# EAGLE design rev_D (EAGLE 9.5.2)
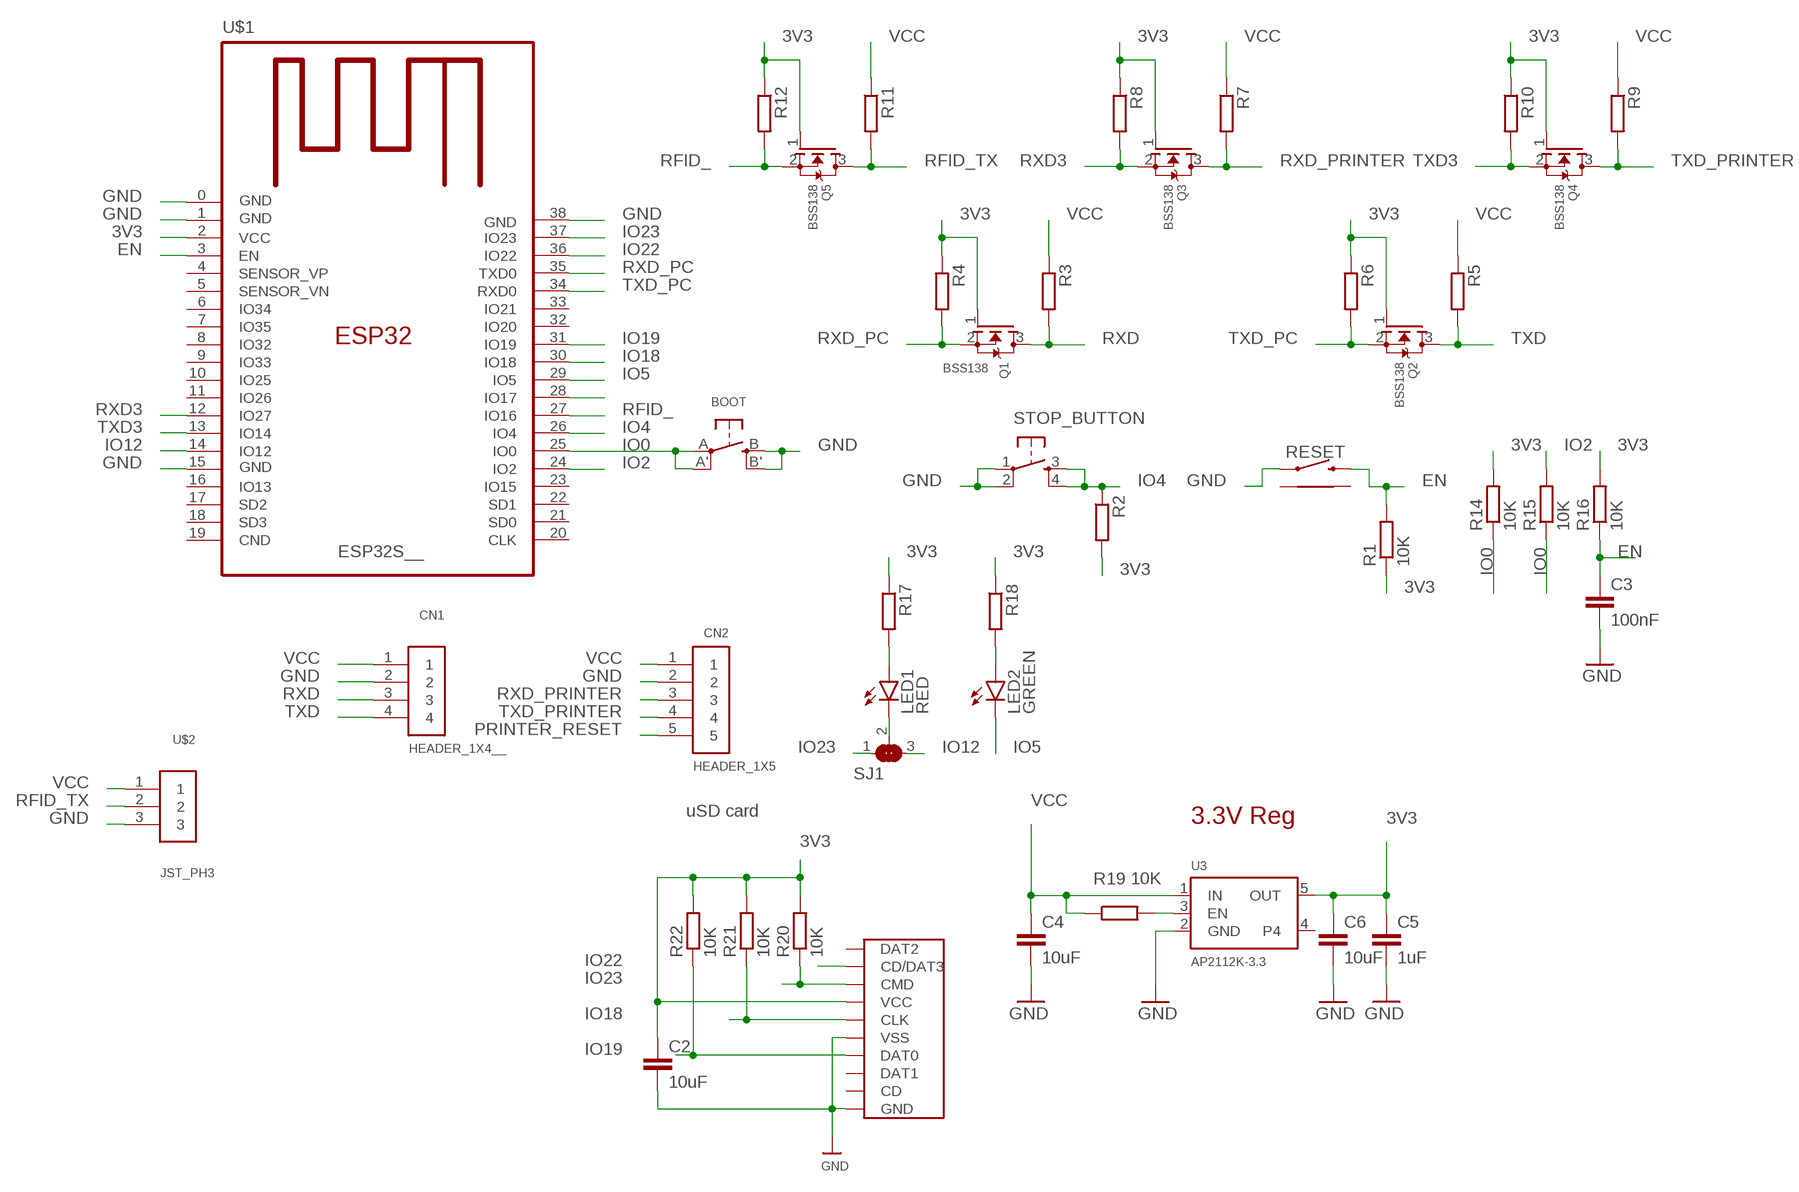
[diagram p0: schematic, sheet 1]

## Parts
BOOT  BUTTON_KMR2_4.6X2.8  [BUTTON_KMR2_4.6X2.8]
C2  10uF  C-EUC0805  [C0805]
C3  100nF  C-EUC0805  [C0805]
C4  10uF  C-EUC0805  [C0805]
C5  1uF  C-EUC0805  [C0805]
C6  10uF  C-EUC0805  [C0805]
CN1  HEADER_1X4__  [HEADER_1X4_RIGHT_ANGLE]
CN2  HEADER_1X5  [HEADER_1X5]
LED1  RED  LEDCHIP-LED0805  [CHIP-LED0805]
LED2  GREEN  LEDCHIP-LED0805  [CHIP-LED0805]
Q1  BSS138  MOSFET_N_  [SOT95P240X110-3]
Q2  BSS138  MOSFET_N_  [SOT95P240X110-3]
Q3  BSS138  MOSFET_N_  [SOT95P240X110-3]
Q4  BSS138  MOSFET_N_  [SOT95P240X110-3]
Q5  BSS138  MOSFET_N_  [SOT95P240X110-3]
R1  10K  R-EU_R0805  [R0805]
R2  10K  R-EU_R0805  [R0805]
R3  10K  R-EU_R0805  [R0805]
R4  10K  R-EU_R0805  [R0805]
R5  10K  R-EU_R0805  [R0805]
R6  10K  R-EU_R0805  [R0805]
R7  10K  R-EU_R0805  [R0805]
R8  10K  R-EU_R0805  [R0805]
R9  10K  R-EU_R0805  [R0805]
R10  10K  R-EU_R0805  [R0805]
R11  10K  R-EU_R0805  [R0805]
R12  10K  R-EU_R0805  [R0805]
R14  10K  R-EU_R0805  [R0805]
R15  10K  R-EU_R0805  [R0805]
R16  10K  R-EU_R0805  [R0805]
R17  470R  R-EU_R0805  [R0805]
R18  470R  R-EU_R0805  [R0805]
R19  10K  R-EU_R0805  [R0805]
R20  10K  R-EU_R0805  [R0805]
R21  10K  R-EU_R0805  [R0805]
R22  10K  R-EU_R0805  [R0805]
RESET  TACTILE_SWITCH_RIGHT_ANGLE_THT_  [TACTILE_SWITCH_RIGHT_ANGLE_THT]
SD_CARD  MICRO_SD_CARD_  [TFP09-2--12B]
SJ1  SOLDERJUMPER_2WAY0805  [SOLDERJUMPER_2WAY_OPEN_0805]
STOP_BUTTON  TACTILE_SWITCH_LONG_THT_  [TACTILE_SWICTH_THT]
U3  AP2112K-3.3  AP2112K-3.3_  [SOT95P290X120-5]
U$1  ESP32S__  [ESP32S]
U$2  JST_PH3  [JST-PH3]

## Nets
3V3: C2.1 C5.1 C6.1 Q1.1(G) Q2.1(G) Q3.1(G) Q4.1(G) Q5.1(G) R1.1 R2.2 R4.1 R6.1 R8.1 R10.1 R12.1 R14.2 R16.2 R17.1 R18.1 R20.2 R21.2 R22.2 SD_CARD.VCC U3.5(OUT) U$1.2(VCC)
EN: C3.1 R1.2 R16.1 RESET.2 U$1.3(EN)
GND: BOOT.B'(S1) BOOT.B(S) C2.2 C3.2 C4.2 C5.2 C6.2 CN1.2 CN2.2 RESET.1 SD_CARD.GND SD_CARD.GND@1(GND) SD_CARD.GND@2(GND) SD_CARD.GND@3(VSS) SD_CARD.VSS(GND) STOP_BUTTON.1 STOP_BUTTON.2 U3.2(GND) U$1.0(GND) U$1.1(GND) U$1.15(GND) U$1.38(GND) U$2.3
IO0: BOOT.A'(P1) BOOT.A(P) R14.1 R15.1 U$1.25(IO0)
IO2: R15.2 U$1.24(IO2)
IO4: R2.1 STOP_BUTTON.3 STOP_BUTTON.4 U$1.26(IO4)
IO5: LED2.C U$1.29(IO5)
IO12: SJ1.3 U$1.14(IO12)
IO18: R21.1 SD_CARD.CLK U$1.30(IO18)
IO19: R22.1 SD_CARD.DAT0 U$1.31(IO19)
IO22: SD_CARD.CD/DAT3 U$1.36(IO22)
IO23: R20.1 SD_CARD.CMD SJ1.1 U$1.37(IO23)
N$1: LED1.C SJ1.2
N$2: U$1.28(IO17)
N$3: LED1.A R17.2
N$4: LED2.A R18.2
N$16: R19.2 U3.3(EN)
PRINTER_RESET: CN2.5
RFID_: Q5.2(S) R12.2 U$1.27(IO16)
RFID_TX: Q5.3(D) R11.2 U$2.2
RXD: CN1.3 Q1.3(D) R3.2
RXD3: Q3.2(S) R8.2 U$1.12(IO27)
RXD_PC: Q1.2(S) R4.2 U$1.35(TXD0)
RXD_PRINTER: CN2.3 Q3.3(D) R7.2
TXD: CN1.4 Q2.3(D) R5.2
TXD3: Q4.2(S) R10.2 U$1.13(IO14)
TXD_PC: Q2.2(S) R6.2 U$1.34(RXD0)
TXD_PRINTER: CN2.4 Q4.3(D) R9.2
VCC: C4.1 CN1.1 CN2.1 R3.1 R5.1 R7.1 R9.1 R11.1 R19.1 U3.1(IN) U$2.1
Unconnected: RESET.ANCHOR1 RESET.ANCHOR2 SD_CARD.CD SD_CARD.DAT1 SD_CARD.DAT2 U3.4 U$1.4(SENSOR_VP) U$1.5(SENSOR_VN) U$1.6(IO34) U$1.7(IO35) U$1.8(IO32) U$1.9(IO33) U$1.10(IO25) U$1.11(IO26) U$1.16(IO13) U$1.17(SD2) U$1.18(SD3) U$1.19(CND) U$1.20(CLK) U$1.21(SD0) U$1.22(SD1) U$1.23(IO15) U$1.32(IO20) U$1.33(IO21)

## Notes on the sheet
- uSD card
- 3.3V Reg

## Library data of the parts
BOOT = dronecz:BUTTON_KMR2_4.6X2.8: SMT Tact Switches 6x6mm - Digikey: P12940SCT-ND KMR2 (4.6x2.8mm) - Digikey: 401-1426-1-ND EVQ-PQHB55 - Light Touch, 160GF (4.5x4.5mm) - Digikey: P8090SCT-ND Farnell (KMR221NG) - 2845727
C2-C6 = rcl:C-EU: CAPACITOR, European symbol; SPICEPREFIX: C
CN1 = dronecz:HEADER_1X4
CN2 = dronecz:HEADER_1X5
LED1 LED2 = led:LED: LED OSRAM: - CHIPLED LG R971, LG N971, LY N971, LG Q971, LY Q971, LO R971, LY R971 LH N974, LH R974 LS Q976, LO Q976, LY Q976 LO Q996 - Hyper CHIPLED LW Q18S LB Q993, LB Q99A, LB R99A - SideLED LS A670, LO A670, LY A670, LG A670, LP A670 LB A673, LV A673, LT A673, LW A673 LH A674 LY A675 LS A676, LA A676, LO A676, LY A676, LW A676 LS A679, LY A679, LG A679 - Hyper Micro SIDELED® LS Y876, LA Y876, LO Y876, LY Y876 LT Y87S - SmartLED LW L88C, LW L88S LB L89C, LB L89S, LG L890 LS L89K, LO L89K, LY L89K LS L896, LA L896, LO L896, LY L896 - TOPLED LS T670, LO T670, LY T670, LG T670, LP T670 LSG T670, LSP T670, LSY T670, LOP T670, LYG T670 LG T671, LOG T671, LSG T671 LB T673, LV T673, LT T673, LW T673 LH T674 LS T676, LA T676, LO T676, LY T676, LB T676, LH T676, LSB T676, LW T676 LB T67C, LV T67C, LT T67C, LS T67K, LO T67K, LY T67K, LW E67C LS E67B, LA E67B, LO E67B, LY E67B, LB E67C, LV E67C, LT E67C LW T67C LS T679, LY T679, LG T679 LS T770, LO T770, LY T770, LG T770, LP T770 LB T773, LV T773, LT T773, LW T773 LH T774 LS E675, LA E675, LY E675, LS T675 LS T776, LA T776, LO T776, LY T776, LB T776 LHGB T686 LT T68C, LB T68C - Hyper Mini TOPLED® LB M676 - Mini TOPLED Santana® LG M470 LS M47K, LO M47K, LY M47K Source: http://www.osram.convergy.de LUXEON: - LUMILED® LXK2-PW12-R00, LXK2-PW12-S00, LXK2-PW14-U00, LXK2-PW14-V00 LXK2-PM12-R00, LXK2-PM12-S00, LXK2-PM14-U00 LXK2-PE12-Q00, LXK2-PE12-R00, LXK2-PE12-S00, LXK2-PE14-T00, LXK2-PE14-U00 LXK2-PB12-K00, LXK2-PB12-L00, LXK2-PB12-M00, LXK2-PB14-N00, LXK2-PB14-P00, LXK2-PB14-Q00 LXK2-PR12-L00, LXK2-PR12-M00, LXK2-PR14-Q00, LXK2-PR14-R00 LXK2-PD12-Q00, LXK2-PD12-R00, LXK2-PD12-S00 LXK2-PH12-R00, LXK2-PH12-S00 LXK2-PL12-P00, LXK2-PL12-Q00, LXK2-PL12-R00 Source: www.luxeon.com KINGBRIGHT: KA-3528ASYC Source: www.kingbright.com
Q1-Q5 = dronecz:MOSFET_N
R1-R12 R14-R22 = rcl:R-EU_: RESISTOR, European symbol; SPICEPREFIX: R
RESET = dronecz:TACTILE_SWITCH_RIGHT_ANGLE_THT
SD_CARD = dronecz:MICRO_SD_CARD
SJ1 = microbuilder:SOLDERJUMPER_2WAY: 2-Way Solder Jumper
STOP_BUTTON = dronecz:TACTILE_SWITCH_LONG_THT
U3 = dronecz:AP2112K-3.3
U$1 = dronecz:ESP32S
U$2 = dronecz:JST_PH3

## Board
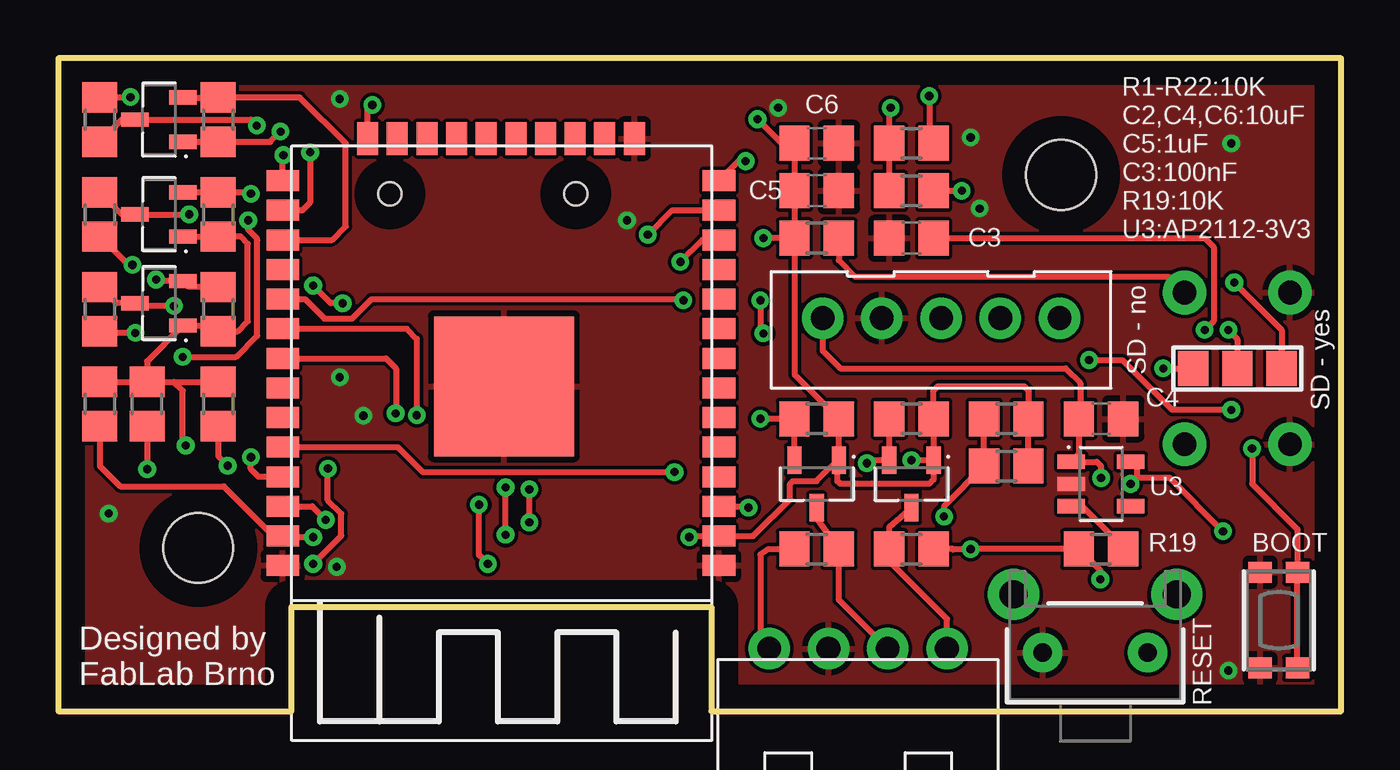
[diagram p1: board, top side]
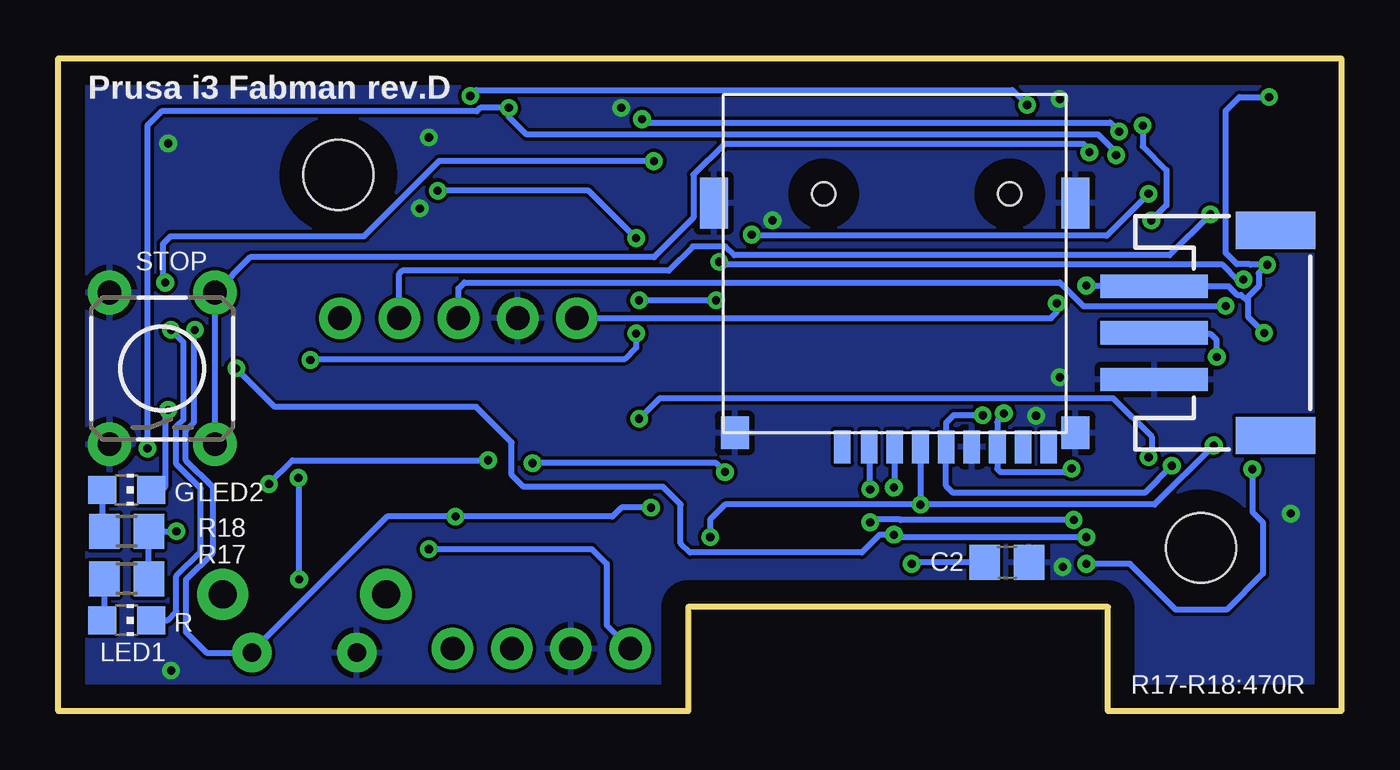
[diagram p2: board, bottom side, seen from below]

Size 55 x 28 mm. Coordinates in mm from the lower left corner, seen from the top.
Outline: 28,0 55,0 55,28 0,28 0,0 10,0 10,4.47 28,4.47 28,0
Copper layers (1*16): Top 0.035mm / dielectric 1.5mm / Bottom 0.035mm
Design rules "default": minimum track width 6mil, minimum drill 0.35mm, track to track 6mil, track to pad 6mil, pad to pad 6mil, via to via 6mil, smd to smd 6mil, copper to edge 40mil, drill to drill 6mil, minimum pad ring 10mil, minimum via ring 8mil, stop-mask expansion 4mil, vias tented up to drill 0mil, thermal gap 10mil
Holes 3 mm at 43,23 6,7

### Footprints (pad centres in the part's own frame; a part is rotated, then mirrored left to right if it is on the bottom)
BUTTON_KMR2_4.6X2.8 = smd 0.9 x 1: A 2.05,0.8; A' -2.05,0.8; B 2.05,-0.8; B' -2.05,-0.8
C0805 = smd 1.3 x 1.5: 1 -0.95,0; 2 0.95,0
HEADER_1X4_RIGHT_ANGLE = drill 1.016 pad 1.778: 1 -3.81,0; 2 -1.27,0; 3 1.27,0; 4 3.81,0
HEADER_1X5 = drill 1.016 pad 1.778: 1 -5.08,0; 2 -2.54,0; 3 0,0; 4 2.54,0; 5 5.08,0
CHIP-LED0805 = smd 1.2 x 1.2: A 0,-1.05; C 0,1.05
SOT95P240X110-3 = smd 1.18 x 0.609: 1 -1.024,0.95; 2 -1.024,-0.95; 3 1.024,0
R0805 = smd 1.3 x 1.5: 1 -0.95,0; 2 0.95,0
TACTILE_SWITCH_RIGHT_ANGLE_THT = drill 0.8 pad 1.7: 1 2.25,0; 2 -2.25,0 | drill 1.2 pad 2.2: ANCHOR1 3.5,-2.5; ANCHOR2 -3.5,-2.5
TFP09-2--12B = smd 0.711 x 1.422: CD -6.6,7.85; CD/DAT3 1.1,7.85; CLK -2.2,7.85; CMD 0,7.85; DAT0 -4.4,7.85; DAT1 -5.5,7.85; DAT2 2.25,7.85; VCC -1.1,7.85; VSS -3.3,7.85 | smd 1.2 x 2.2: GND -7.75,-2.6; GND@1 7.75,-2.6 | smd 1.2 x 1.4: GND@2 -7.75,7.25; GND@3 6.85,7.25 | hole 1: -4.93,-3; 3.05,-3
SOLDERJUMPER_2WAY_OPEN_0805 = smd 1.3 x 1.5: 1 -1.9,0; 2 0,0; 3 1.9,0
TACTILE_SWICTH_THT = drill 1.016 pad 1.88: 1 -3.251,2.261; 2 3.251,2.261; 3 -3.251,-2.261; 4 3.251,-2.261
SOT95P290X120-5 = smd 1.18 x 0.609: 1 -1.274,0.95; 2 -1.274,0; 3 -1.274,-0.95; 4 1.274,-0.95; 5 1.274,0.95
ESP32S = smd 6 x 6: 0 0.026,-0.121 | smd 1.4 x 0.9: 1 -9.194,7.569; 2 -9.194,6.298; 3 -9.194,5.029; 4 -9.194,3.759; 5 -9.194,2.489; 6 -9.194,1.218; 7 -9.194,-0.051; 8 -9.194,-1.321; 9 -9.194,-2.591; 10 -9.194,-3.861; 11 -9.194,-5.131; 12 -9.194,-6.402; 13 -9.194,-7.671; 14 -9.194,-8.941; 25 9.507,-8.941; 26 9.507,-7.671; 27 9.507,-6.402; 28 9.507,-5.131; 29 9.507,-3.861; 30 9.507,-2.591; 31 9.507,-1.321; 32 9.507,-0.051; 33 9.507,1.218; 34 9.507,2.489; 35 9.507,3.759; 36 9.507,5.029; 37 9.507,6.298; 38 9.507,7.569 | smd 0.9 x 1.4: 15 -5.564,-10.742; 16 -4.293,-10.742; 17 -3.023,-10.742; 18 -1.754,-10.742; 19 -0.483,-10.742; 20 0.786,-10.742; 21 2.057,-10.742; 22 3.326,-10.742; 23 4.596,-10.742; 24 5.867,-10.742
JST-PH3 = smd 1 x 4.6: 1 -2,-3.7; 2 0,-3.7; 3 2,-3.7 | smd 1.6 x 3.4: NC1 -4.4,1.5; NC2 4.4,1.5

### Placement (x,y rotation side)
BOOT  52.32,3.9 270 top
C2  14.33,6.38 0 bottom
C3  36.58,20.29 180 top
C4  44.7,12.54 0 top
C5  32.51,22.32 0 top
C6  32.51,24.35 0 top
CN1  34.29,2.68 0 top
CN2  37.85,16.86 0 top
LED1  52.07,3.9 270 bottom
LED2  52.07,9.49 270 bottom
Q1  32.51,9.75 270 top
Q2  36.58,9.75 270 top
Q3  4.32,17.49 180 top
Q4  4.32,21.3 180 top
Q5  4.32,25.37 180 top
R1  40.64,12.54 180 top
R2  32.51,20.29 180 top
R3  32.51,6.95 0 top
R4  32.51,12.54 180 top
R5  36.58,6.95 180 top
R6  36.58,12.54 180 top
R7  1.78,17.24 90 top
R8  6.86,17.24 90 top
R9  1.78,21.3 90 top
R10  6.86,21.3 90 top
R11  1.78,25.37 270 top
R12  6.86,25.37 90 top
R14  36.58,22.32 0 top
R15  36.58,24.35 0 top
R16  40.64,10.51 0 top
R17  52.07,5.68 180 bottom
R18  52.07,7.71 180 bottom
R19  44.7,6.95 0 top
R20  1.78,13.18 90 top
R21  6.86,13.18 90 top
R22  3.8,13.18 90 top
RESET  44.45,2.51 180 top
SD_CARD  19.14,19.19 180 bottom
SJ1  50.55,14.7 0 top
STOP_BUTTON  50.55,14.7 90 bottom
U3  44.7,9.75 0 top
U$1  19.13,13.81 180 top
U$2  4.32,16.22 270 bottom

### Tracks (layer width: path | path; a pad name or v marks a point on that pad's centre or on a via)
3V3  (via drill 0.35)
  Top 0.254: Q1.1 R4.1 31.56,14.44 R2.2 | Q1.1 33.46,10.82 32.51,9.87 31.5,9.87 31.37,9.75 31.37,9.09 29.79,7.51 U$1.2 27.1,7.51 v27.05,7.46 | R2.2 C5.1 C6.1 31.01,24.35 v29.97,25.39 | Q2.1 R6.1 37.53,13.74 37.72,13.94 41.4,13.94 41.59,13.75 R1.1 R16.2 | Q2.1 37.53,9.94 37.34,9.75 33.53,9.75 33.4,9.87 33.4,10.71 Q1.1 | v36.58,10.76 36.58,10.77 Q2.1 | 46.23,10.01 v45.97,9.75 | v49.93,7.71 47.64,10.01 46.23,10.01 | Q5.1 R12.1 9.08,24.42 v9.53,24.86 | Q4.1 R10.1 7.81,20.35 8.13,20.03 8.13,16.73 7.69,16.29 R8.1 6.6,16.54 Q3.1 3.8,15 R22.2 | R14.2 v38.73,22.32 | R2.2 v30.23,20.29 | U3.5 46.23,10.44 46.23,10.01 | R20.2 R22.2 | R22.2 4.95,14.13 | 4.95,14.13 R21.2 | v5.46,11.4 5.33,11.53 5.33,13.74 4.95,14.13 | v18.41,6.32 18.29,6.45 18.03,6.7 v18.03,8.86
  Bottom 0.254: v45.97,9.75 44.96,10.76 v36.58,10.76 | R17.1 R18.1 v49.93,7.71 | v5.46,11.4 8,8.86 v18.03,8.86 | v27.05,7.46 27.05,8.22 26.42,8.86 v18.03,8.86 | v9.53,24.86 9.91,25.24 29.82,25.24 v29.97,25.39 | v30.23,20.29 32.26,22.32 v38.73,22.32 | C2.1 18.35,6.38 v18.41,6.32 | SD_CARD.VCC v18.04,8.86 v18.03,8.86
EN  (via drill 0.35)
  Top 0.254: U$1.3 29.54,8.78 v29.59,8.73 | R1.2 R16.1 37.97,8.79 v37.97,8.35 | C3.1 49.15,20.29 49.53,19.91 49.53,16.73 v49.15,16.35
  Bottom 0.254: v29.59,8.73 30.86,8.73 31.24,8.35 v37.97,8.35 40.89,8.35 46.7,2.54 RESET.2 48.64,2.51 49.53,3.4 49.53,5.63 48.39,6.78 48.39,9.62 49.53,10.76 49.53,12.03 49.2,12.36 49.2,16.3 v49.15,16.35
GND  (via drill 0.35)
  other vias: 39.5,21.56 50.16,1.75 24.38,21.05 13.08,12.67 2.16,8.48 11.94,6.19 12.06,14.32 50.29,24.35 39.12,24.61 30.86,25.88 12.06,26.26
  pour Bottom: 0,28.16 -0.13,-0.03 54.99,-0.03 55.12,28.16
  pour Top: -0.13,28.16 -0.13,-0.03 55.12,-0.03 55.12,28.16
IO0  (via drill 0.35)
  Top 0.254: R14.1 R15.1 35.63,25.82 v35.69,25.88 | v51.18,11.27 51.18,9.75 53.12,7.8 BOOT.A' BOOT.A | U$1.25 9.62,23.82 v9.65,23.84
  Bottom 0.254: v51.18,11.27 51.18,25.11 50.57,25.73 37.07,25.73 36.92,25.88 v35.69,25.88 35.69,25.5 34.92,24.73 10.41,24.73 9.65,23.97 v9.65,23.84
IO2  (via drill 0.35)
  Top 0.254: v13.46,26 13.26,25.8 U$1.24 | v37.34,26.38 37.34,24.54 R15.2
  Bottom 0.254: v37.34,26.38 37.08,26.64 14.1,26.64 v13.46,26
IO4  (via drill 0.35)
  Top 0.254: R2.1 33.46,19.34 34.16,18.64 47.6,18.64 STOP_BUTTON.4 | U$1.26 10.47,21.48 10.79,21.81 v10.79,23.97
  Bottom 0.254: STOP_BUTTON.3 STOP_BUTTON.4 46.77,19.47 29.46,19.47 27.77,21.16 27.77,23 26.45,24.33 11.05,24.33 10.79,24.07 v10.79,23.97
IO5  (via drill 0.35)
  Top 0.254: v26.8,17.62 26.74,17.67 13.43,17.67 12.59,16.84 11.41,16.84 10.57,17.67 U$1.29 | v30.1,17.62 30.1,16.33 v30.23,16.2 | v50.29,12.92 47.75,12.92 45.62,15.06 v44.2,15.06
  Bottom 0.254: v26.8,17.62 v30.1,17.62 | v30.23,16.2 30.23,15.59 30.71,15.11 44.15,15.11 v44.2,15.06 | LED2.C 50.55,9.49 50.42,9.62 50.42,12.79 v50.29,12.92
IO12  (via drill 0.35)
  Top 0.254: U$1.14 29.16,23.59 v29.46,23.59 | v50.42,18.38 52.45,16.35 52.45,15.46 52.45,15.45 SJ1.3
  Bottom 0.254: v29.46,23.59 38.67,23.59 41.91,20.36 50.2,20.36 50.52,20.03 50.52,18.48 v50.42,18.38
IO18  (via drill 0.35)
  Top 0.254: R21.1 6.86,10.93 v7.26,10.53 | U$1.30 14.93,16.4 15.37,15.97 v15.37,12.69
  Bottom 0.254: v7.26,10.53 8.42,9.37 16.64,9.37 16.94,9.67 SD_CARD.CLK 16.94,12.37 16.61,12.69 v15.37,12.69
IO19  (via drill 0.35)
  Top 0.254: R22.1 3.8,10.39 v3.81,10.38 | U$1.31 14.04,15.13 14.48,14.7 14.48,12.79 v14.46,12.77 | v11.56,10.4 11.56,9.04 12.12,8.47 12.12,7.52 v10.92,6.32
  Bottom 0.254: v3.81,10.38 3.81,8.55 3.36,8.1 3.36,5.91 4.91,4.36 7.09,4.36 9.06,6.32 v10.92,6.32 | v14.46,12.77 14.71,12.52 14.71,12.42 14.74,12.39 14.74,11.14 SD_CARD.DAT0 14.74,10.39 14.61,10.26 11.71,10.26 v11.56,10.4
IO22  (via drill 0.35)
  Top 0.254: U$1.36 10.88,8.78 v11.47,8.2 | v20.19,8.1 v20.19,9.52
  Bottom 0.254: v11.47,8.2 18.88,8.2 18.91,8.22 20.07,8.22 v20.19,8.1 | v20.19,9.52 20.19,11.29 SD_CARD.CD/DAT3
IO23  (via drill 0.35)
  Top 0.254: v10.92,7.46 9.68,7.46 | 9.68,7.46 U$1.37 | 9.68,7.46 9.28,7.46 7.09,9.64 2.64,9.64 1.78,10.51 R20.1 | v19.18,7.57 v19.18,9.6 | v47.37,14.7 SJ1.1
  Bottom 0.254: v10.92,7.46 19.07,7.46 v19.18,7.57 19.79,7.57 20.56,6.8 27.92,6.8 28.32,7.21 28.32,8.86 29.08,9.62 35.05,9.62 35.56,10.13 35.56,11.53 37.08,13.05 45.72,13.05 v47.37,14.7 | v19.18,9.6 19.14,9.63 SD_CARD.CMD
N$1  (via drill 0.35)
  Top 0.254: v50.16,16.35 50.55,15.97 SJ1.2
  Bottom 0.254: LED1.C 50.32,3.9 49.94,4.29 49.94,5.8 48.9,6.84 48.9,9.55 49.94,10.6 49.94,12.2 49.63,12.5 49.63,15.82 v50.16,16.35
N$3
  Bottom 0.254: LED1.A 53.02,4 R17.2
N$4
  Bottom 0.254: LED2.A 53.12,7.82 R18.2
N$16
  Top 0.254: U3.3 43.88,8.8 45.65,7.02 R19.2
RFID_
  Top 0.254: Q5.2 R12.2 10.35,26.32 12.32,24.35 12.32,20.8 11.74,20.21 U$1.27
RFID_TX  (via drill 0.35)
  Top 0.254: R11.2 2.73,25.37 Q5.3 8.26,25.37 v8.51,25.11 | v8.14,21.05 8.14,20.66 8.51,20.29 8.51,20.23 8.53,20.2 8.53,16.11 7.62,15.19 v5.33,15.19
  Bottom 0.254: v8.51,25.11 8.51,24.23 7.49,23.21 7.49,21.7 v8.14,21.05 | v5.33,15.19 5.33,15.92 5.58,16.17 7.96,16.17 U$2.2
RXD
  Top 0.254: Q1.3 32.51,8.28 R3.2 33.46,4.78 CN1.3
RXD3  (via drill 0.35)
  Top 0.254: R8.2 5.6,18.19 Q3.2 4.26,18.44 v4.19,18.51 | v26.67,19.27 27.61,20.21 U$1.12
  Bottom 0.254: v4.19,18.51 4.45,18.51 5.08,19.14 26.54,19.14 v26.67,19.27
RXD_PC  (via drill 0.35)
  Top 0.254: Q1.2 R4.2 v30.1,12.54 | U$1.35 8.58,10.05 8.26,10.38 v8.26,10.89
  Bottom 0.254: v8.26,10.89 8.13,11.02 8.13,11.78 9.78,13.43 29.21,13.43 v30.1,12.54
RXD_PRINTER  (via drill 0.35)
  Top 0.254: Q3.3 3.17,17.49 | 3.17,17.49 2.47,17.49 R7.2 | v4.95,17.38 3.29,17.38 3.17,17.49
  Bottom 0.254: CN2.3 37.85,18.13 37.59,18.38 12.06,18.38 11.05,17.37 4.96,17.37 v4.95,17.38
TXD
  Top 0.254: CN1.4 38.1,3.95 35.63,6.43 R5.2 35.63,7.9 Q2.3
TXD3  (via drill 0.35)
  Top 0.254: Q4.2 R10.2 8.19,22.25 v8.26,22.19 | v25.27,20.44 26.32,21.48 U$1.13
  Bottom 0.254: v8.26,22.19 10.06,20.39 25.23,20.39 v25.27,20.44
TXD_PC  (via drill 0.35)
  Top 0.254: R6.2 Q2.2 34.81,10.77 v34.67,10.64 | U$1.34 14.55,11.32 15.62,10.26 v26.42,10.26
  Bottom 0.254: v26.42,10.26 26.8,10.64 v34.67,10.64
TXD_PRINTER  (via drill 0.35)
  Top 0.254: R9.2 2.73,21.3 Q4.3 v5.61,21.3
  Bottom 0.254: CN2.4 40.39,18.76 40.26,18.89 28.83,18.89 27.79,19.93 26.4,19.93 26.02,19.55 7.36,19.55 v5.61,21.3
VCC  (via drill 0.35)
  Top 0.254: CN1.1 30.1,3.06 30.1,6.71 30.47,6.95 R3.1 | R5.1 38.35,6.95 38.37,6.94 38.38,6.95 v39.12,6.95 R19.1 44.67,6.03 v44.67,5.65 | v44.7,10 44.7,10.51 44.52,10.7 U3.1 43.75,11.02 C4.1 43.81,12.6 43.81,14.06 43.18,14.7 33.53,14.7 32.77,15.46 CN2.1 | v3.3,16.22 1.84,16.22 R7.1 | R9.1 2.99,19.14 v3.17,19.14 | R11.1 1.8,26.34 v3.09,26.34 | v12.19,17.49 11.68,17.49 v10.92,18.26
  Bottom 0.254: v39.12,6.95 32.13,6.95 31.5,6.32 31.5,3.7 CN1.1 | v44.67,5.65 44.67,9.97 v44.7,10 | U$2.1 7.87,18.22 | 7.87,18.22 4.83,18.22 4.46,17.85 4.29,17.85 4,17.56 | v3.3,16.22 4,16.92 4,17.56 | 4,17.56 4,17.77 3.53,18.24 3.53,18.79 v3.17,19.14 3.9,19.14 3.92,19.17 4.47,19.17 4.95,19.65 4.95,25.75 4.36,26.34 v3.09,26.34 | CN2.1 12.45,16.86 12.19,17.11 v12.19,17.49 | v10.92,18.26 7.91,18.26 7.87,18.22

### Text on the board
bPlace: Prusa i3 Fabman rev.D
tNames: R1-R22:10K / C2,C4,C6:10uF / C5:1uF / C3:100nF / R19:10K / U3:AP2112-3V3 | SD - no | SD - yes | Designed by / FabLab Brno
bNames: STOP | G | R | R17-R18:470R